# EAGLE design Robot_v2 (EAGLE 9.5.2)
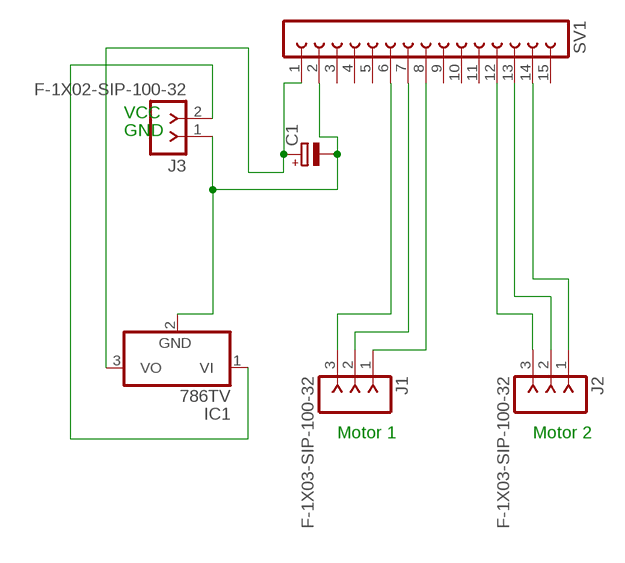
[diagram p0: schematic, sheet 1]

## Parts
C1  CPOL-EUE1.8-4  [E1,8-4]
IC1  786TV  [TO220V]
J1  F-1X03-SIP-100-32  [SIP-100-03-32]
J2  F-1X03-SIP-100-32  [SIP-100-03-32]
J3  F-1X02-SIP-100-32  [SIP-100-02-32]
SV1  FE15-1  [FE15]

## Nets
N$2: C1.- IC1.2(GND) J3.1 SV1.2
N$3: J2.1 SV1.14
N$4: J2.2 SV1.13
N$5: J2.3 SV1.12
N$6: J1.1 SV1.8
N$7: J1.2 SV1.7
N$8: J1.3 SV1.6
N$9: IC1.1(VI) J3.2
N$10: C1.+ IC1.3(VO) SV1.1
Unconnected: SV1.3 SV1.4 SV1.5 SV1.9 SV1.10 SV1.11 SV1.15

## Notes on the sheet
- VCC
- GND
- Motor 1 | Motor 2

## Library data of the parts
C1 = rcl:CPOL-EU: POLARIZED CAPACITOR, European symbol; SPICEPREFIX: C
IC1 = linear:78*: Positive VOLTAGE REGULATOR Source: http://cache.national.com/ds/LM/LM78L05.pdf http://www.fairchildsemi.com/ds/LM/LM7805.pdf
J1 J2 = con-headers-jp:F-1X03-: FEMALE HEADER
J3 = con-headers-jp:F-1X02-: FEMALE HEADER
SV1 = con-lsta:FE15-1: FEMALE HEADER; OC_FARNELL: unknown; OC_NEWARK: unknown

## Net classes
0 default: width 0.33 mm, clearance 0.33 mm

## Board
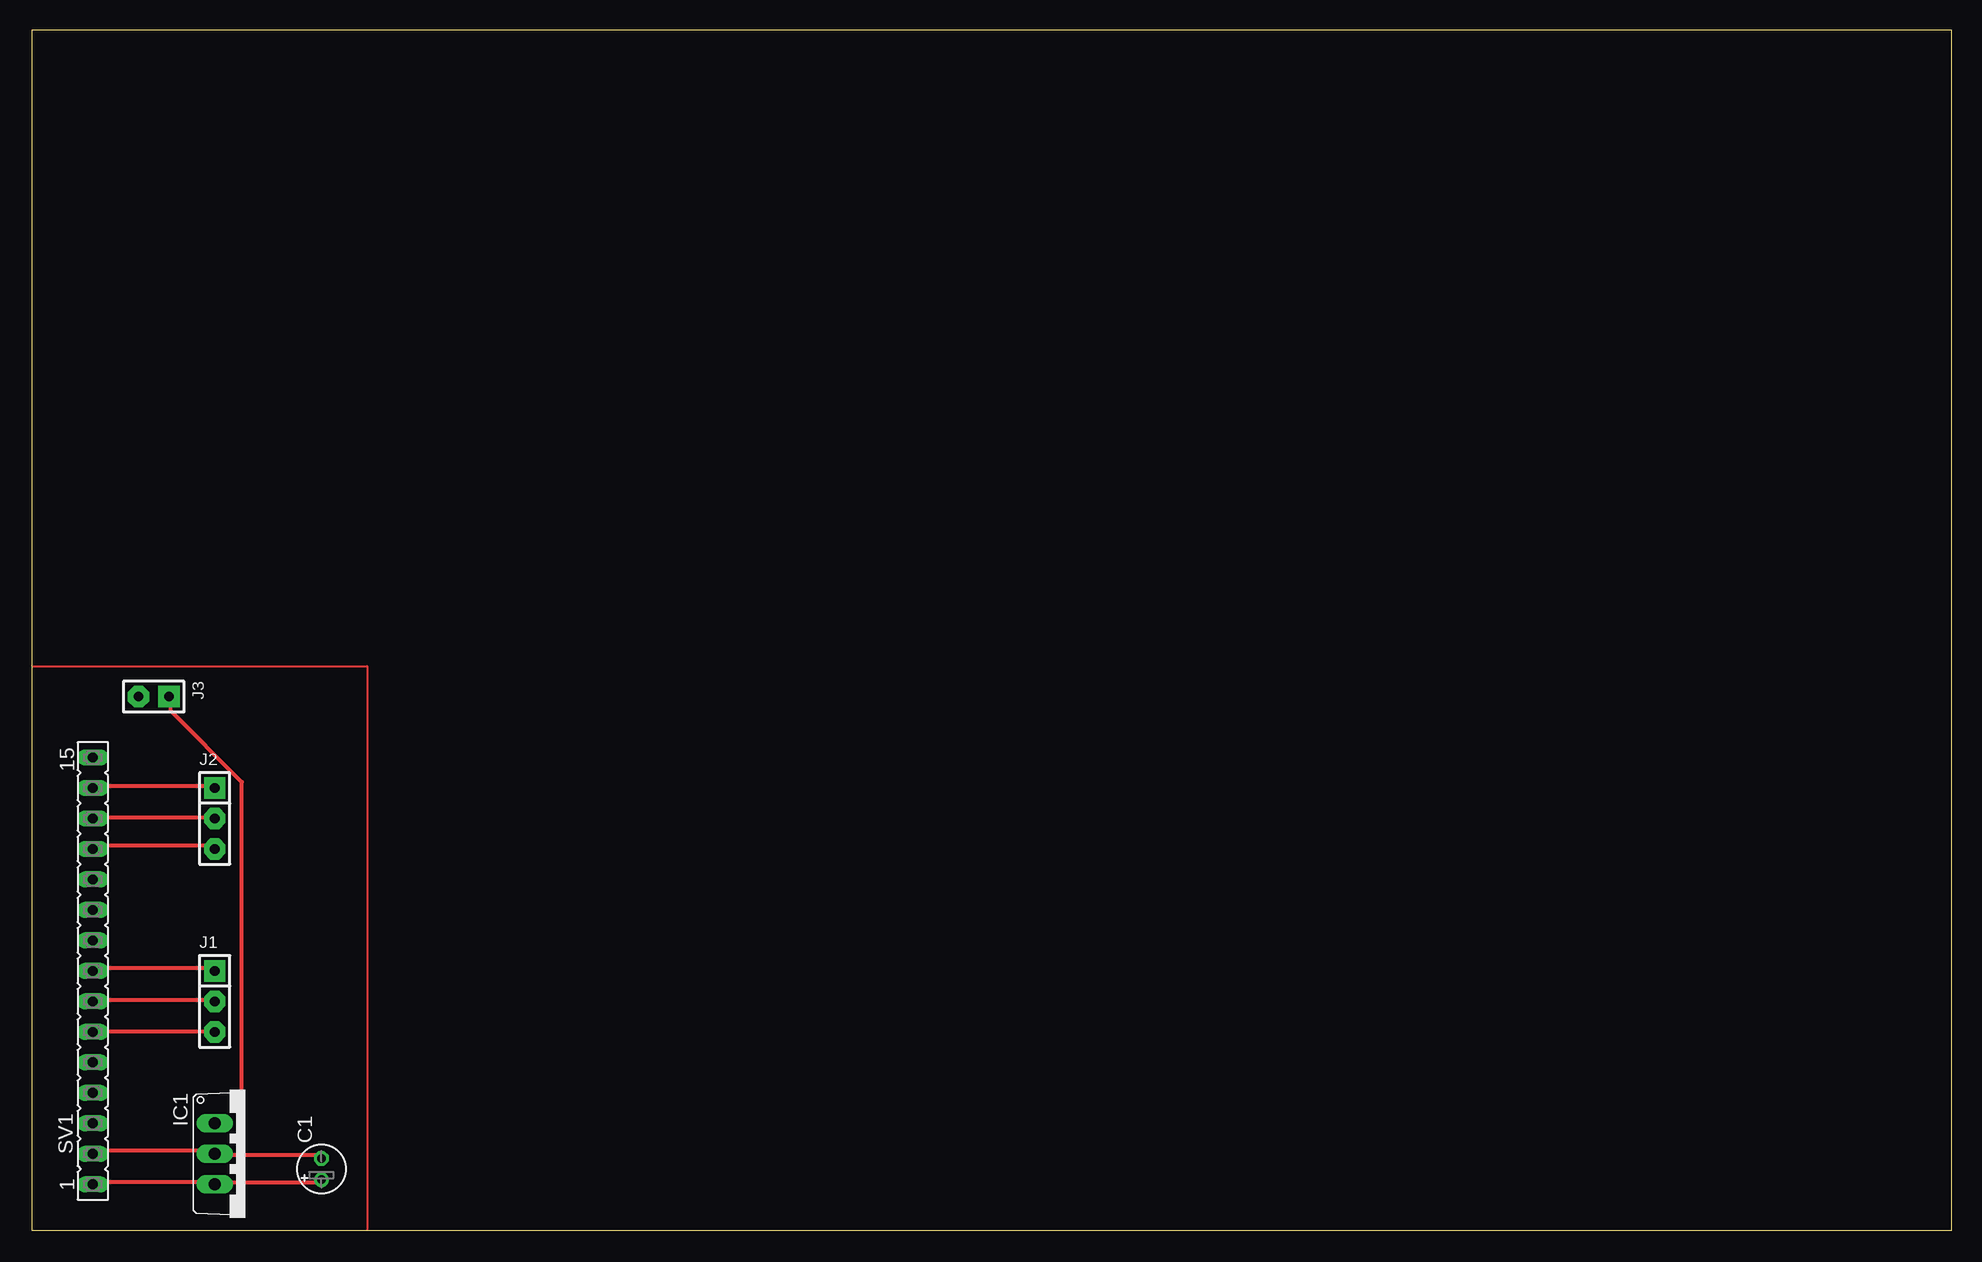
[diagram p1: board, top side]
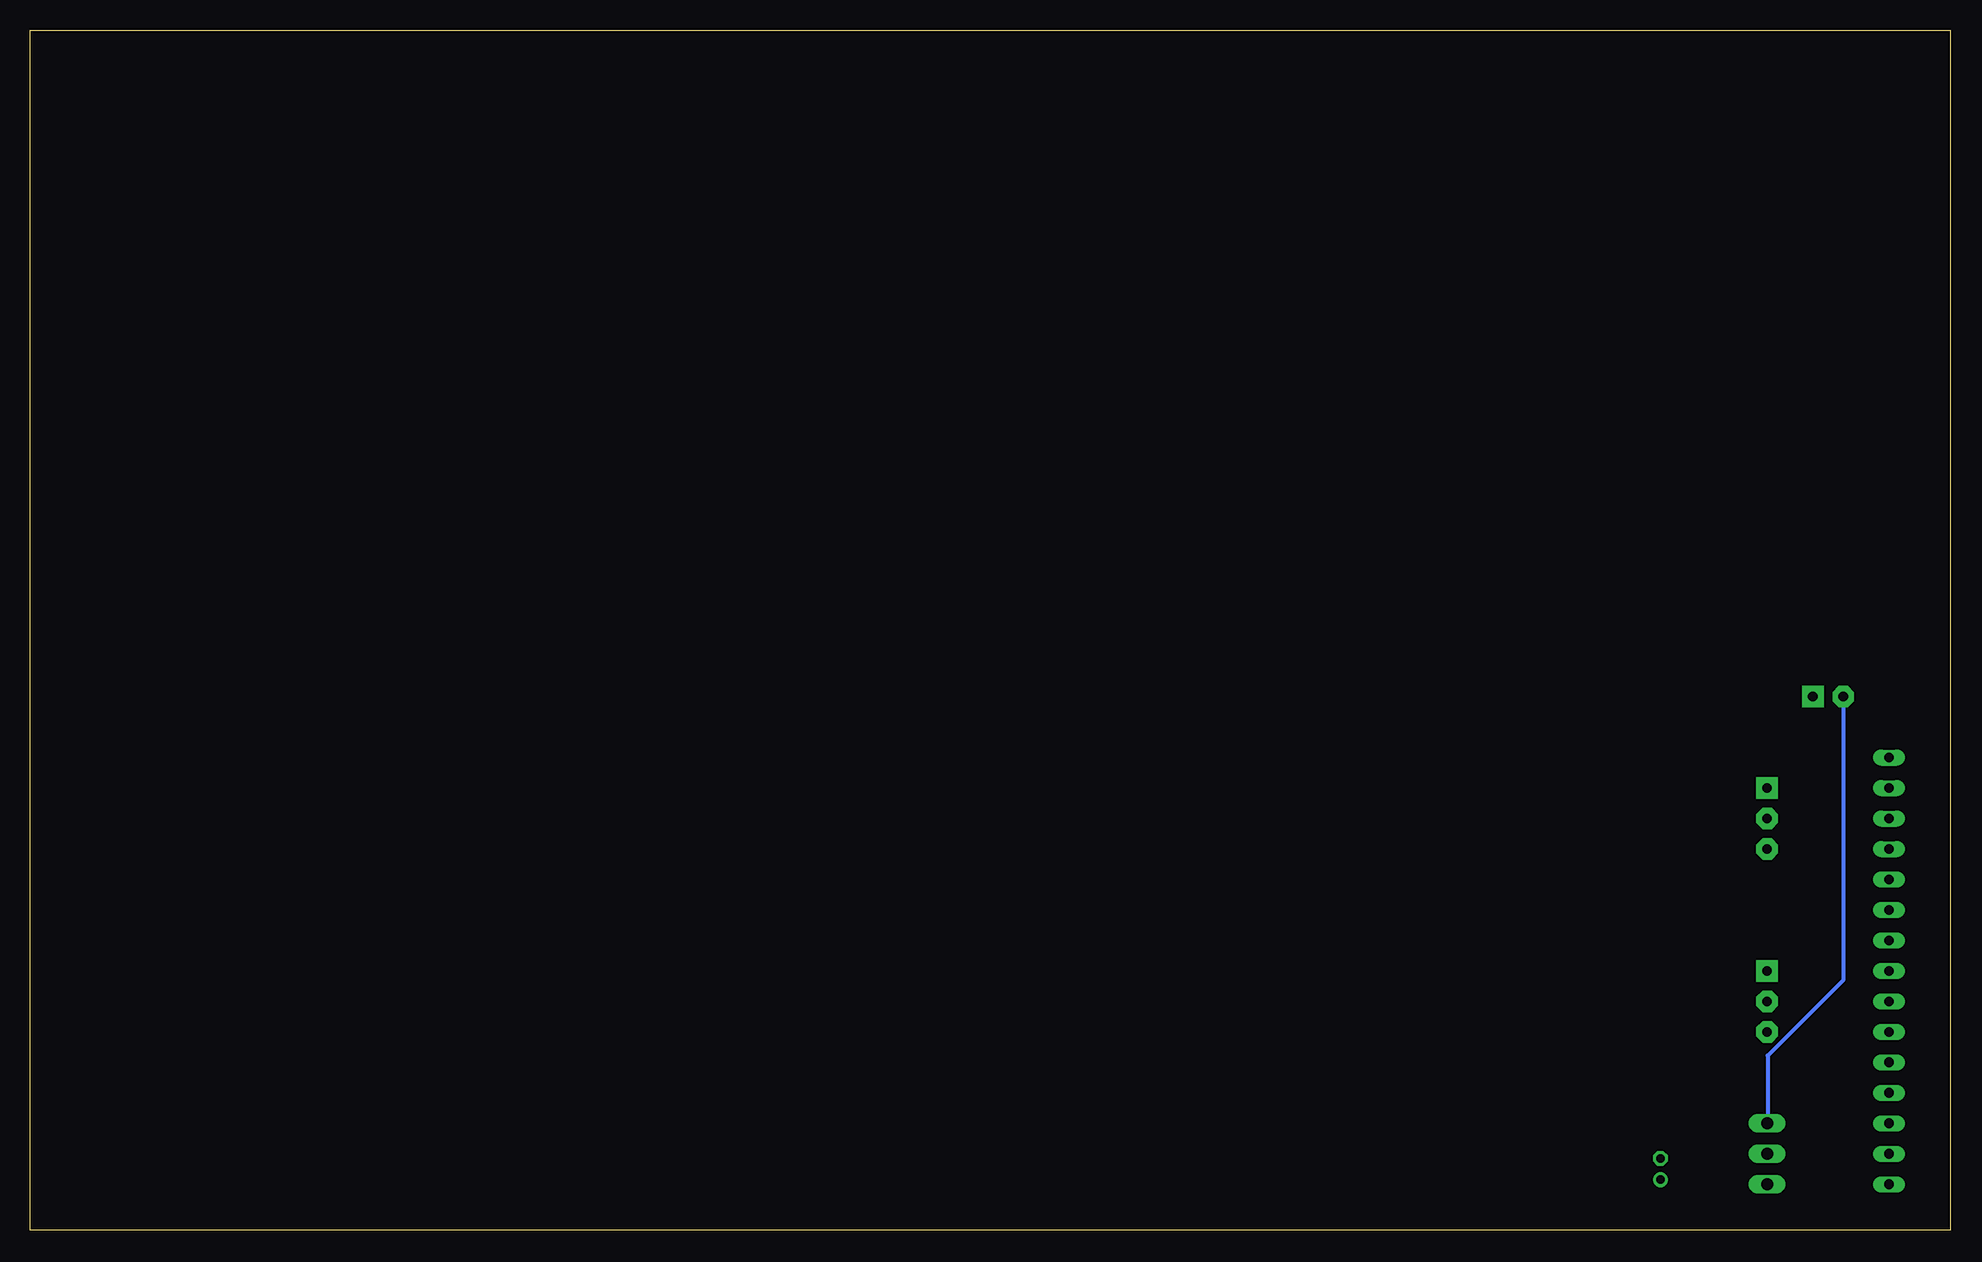
[diagram p2: board, bottom side, seen from below]

Size 160 x 100 mm. Coordinates in mm from the lower left corner, seen from the top.
Outline: 0,0 160,0 160,100 0,100 0,0
Copper layers (1*16): Top 0.035mm / dielectric 1.5mm / Bottom 0.035mm
Design rules "default *": minimum track width 6mil, minimum drill 0.35mm, track to track 13mil, track to pad 13mil, pad to pad 13mil, via to via 13mil, smd to smd 13mil, copper to edge 40mil, drill to drill 6mil, minimum pad ring 10mil, minimum via ring 8mil, stop-mask expansion 4mil, vias tented up to drill 0mil, thermal gap 10mil

### Footprints (pad centres in the part's own frame; a part is rotated, then mirrored left to right if it is on the bottom)
E1,8-4 = drill 0.711 pad 1.168: + -0.889,0 | drill 0.711 pad 1.168 octagon: - 0.889,0
TO220V = drill 1.016 long: 1 -2.54,-2.54; 2 0,-2.54; 3 2.54,-2.54
SIP-100-03-32 = drill 0.813 pad 1.778 square: 1 -2.54,0 | drill 0.813 pad 1.778 octagon: 2 0,0; 3 2.54,0
SIP-100-02-32 = drill 0.813 pad 1.778 square: 1 -1.27,0 | drill 0.813 pad 1.778 octagon: 2 1.27,0
FE15 = drill 0.813 long: 1 -17.78,0; 2 -15.24,0; 3 -12.7,0; 4 -10.16,0; 5 -7.62,0; 6 -5.08,0; 7 -2.54,0; 8 0,0; 9 2.54,0; 10 5.08,0; 11 7.62,0; 12 10.16,0; 13 12.7,0; 14 15.24,0; 15 17.78,0

### Placement (x,y rotation side)
C1  24.13,5.08 90 top
IC1  17.78,6.35 270 top
J1  15.24,19.05 270 top
J2  15.24,34.29 270 top
J3  10.16,44.45 180 top
SV1  5.08,21.59 90 top

### Tracks (layer width: path | path; a pad name or v marks a point on that pad's centre or on a via)
N$1
  Top 0.152: 0,46.99 27.94,46.99 27.94,0
N$2
  Top 0.33: 17.5,6.27 15.52,6.27 IC1.2 15.19,6.6 5.28,6.6 SV1.2 | 17.5,6.27 24.11,6.27 C1.- | 17.5,6.27 17.5,37.31 11.56,43.26 11.56,44.25 J3.1
N$3
  Top 0.33: SV1.14 5.28,36.98 15.19,36.98 J2.1
N$4
  Top 0.33: SV1.13 5.28,34.34 15.19,34.34 J2.2
N$5
  Top 0.33: SV1.12 5.28,32.03 15.19,32.03 J2.3
N$6
  Top 0.33: SV1.8 5.28,21.79 15.19,21.79 J1.1
N$7
  Top 0.33: SV1.7 5.28,19.15 15.19,19.15 J1.2
N$8
  Top 0.33: J1.3 SV1.6
N$9
  Bottom 0.33: IC1.1 15.19,8.91 15.19,14.53 8.91,20.8 8.91,44.25 J3.2
N$10
  Top 0.33: C1.+ 24.11,3.96 15.52,3.96 IC1.3 15.19,3.96 5.28,3.96 SV1.1